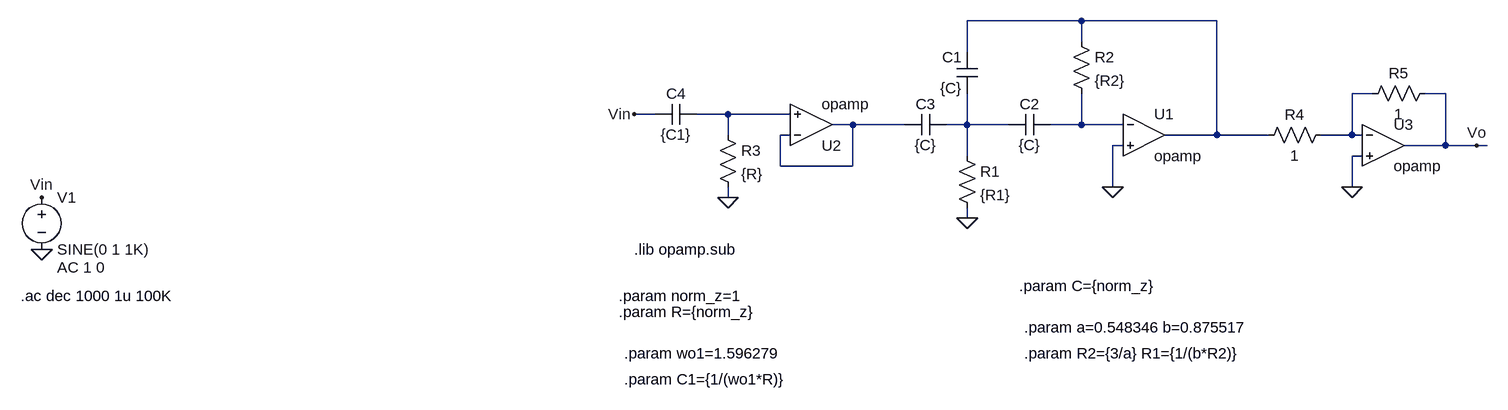
[diagram p0: schematic MFB_normalizado.asc]
MFB_normalizado.asc, the LTspice schematic file:
Version 4.1
SHEET 1 2160 696
WIRE 432 -64 256 -64
WIRE 640 -64 432 -64
WIRE 432 -32 432 -64
WIRE 256 -16 256 -64
WIRE 880 48 848 48
WIRE 992 48 960 48
WIRE -224 80 -256 80
WIRE -112 80 -160 80
WIRE -16 80 -112 80
WIRE 80 96 48 96
WIRE 160 96 80 96
WIRE 256 96 256 48
WIRE 256 96 224 96
WIRE 320 96 256 96
WIRE 432 96 432 48
WIRE 432 96 384 96
WIRE 496 96 432 96
WIRE -112 112 -112 80
WIRE -16 112 -32 112
WIRE 640 112 640 -64
WIRE 640 112 560 112
WIRE 720 112 640 112
WIRE 848 112 848 48
WIRE 848 112 800 112
WIRE 864 112 848 112
WIRE 496 128 480 128
WIRE 992 128 992 48
WIRE 992 128 928 128
WIRE 1040 128 992 128
WIRE 1056 128 1040 128
WIRE 256 144 256 96
WIRE 864 144 848 144
WIRE -32 160 -32 112
WIRE 80 160 80 96
WIRE 80 160 -32 160
WIRE 480 192 480 128
WIRE 848 192 848 144
WIRE -112 208 -112 192
WIRE 256 240 256 224
FLAG -1168 288 0
FLAG -1168 208 Vin
FLAG 480 192 0
FLAG 256 240 0
FLAG 1040 128 Vo
FLAG -112 208 0
FLAG -256 80 Vin
FLAG 848 192 0
SYMBOL OpAmps\\opamp 528 48 R0
SYMATTR InstName U1
SYMBOL voltage -1168 192 R0
WINDOW 123 24 124 Left 2
WINDOW 39 0 0 Left 0
SYMATTR Value2 AC 1 0
SYMATTR InstName V1
SYMATTR Value SINE(0 1 1K)
SYMBOL res 240 128 R0
SYMATTR InstName R1
SYMATTR Value {R1}
SYMBOL cap 272 48 R180
WINDOW 0 24 56 Left 2
WINDOW 3 24 8 Left 2
SYMATTR InstName C1
SYMATTR Value {C}
SYMBOL cap 320 112 R270
WINDOW 0 32 32 VTop 2
WINDOW 3 0 32 VBottom 2
SYMATTR InstName C2
SYMATTR Value {C}
SYMBOL cap 160 112 R270
WINDOW 0 32 32 VTop 2
WINDOW 3 0 32 VBottom 2
SYMATTR InstName C3
SYMATTR Value {C}
SYMBOL res 416 -48 R0
SYMATTR InstName R2
SYMATTR Value {R2}
SYMBOL res -128 96 R0
SYMATTR InstName R3
SYMATTR Value {R}
SYMBOL cap -160 64 R90
WINDOW 0 0 32 VBottom 2
WINDOW 3 32 32 VTop 2
SYMATTR InstName C4
SYMATTR Value {C1}
SYMBOL OpAmps\\opamp 16 160 M180
SYMATTR InstName U2
SYMBOL OpAmps\\opamp 896 64 R0
SYMATTR InstName U3
SYMBOL res 816 96 R90
WINDOW 0 0 56 VBottom 2
WINDOW 3 32 56 VTop 2
SYMATTR InstName R4
SYMATTR Value 1
SYMBOL res 976 32 R90
WINDOW 0 0 56 VBottom 2
WINDOW 3 32 56 VTop 2
SYMATTR InstName R5
SYMATTR Value 1
TEXT -1200 360 Left 2 !.ac dec 1000 1u 100K
TEXT -256 288 Left 2 !.lib opamp.sub
TEXT 336 344 Left 2 !.param C={norm_z}
TEXT 344 408 Left 2 !.param a=0.548346 b=0.875517
TEXT 344 448 Left 2 !.param R2={3/a} R1={1/(b*R2)}
TEXT -280 360 Left 2 !.param norm_z=1
TEXT -280 384 Left 2 !.param R={norm_z}
TEXT -272 448 Left 2 !.param wo1=1.596279
TEXT -272 488 Left 2 !.param C1={1/(wo1*R)}

The netlist it stands for:
* MFB_normalizado.asc
X§U1 N006 0 N001 opamp Aol=100K GBW=10Meg  ; pins invin noninvin out
V1 Vin 0 SINE(0 1 1K) AC 1 0
R1 N005 0 {R1}
C1 N005 N001 {C}
C2 N005 N006 {C}
C3 N004 N005 {C}
R2 N001 N006 {R2}
R3 N003 0 {R}
C4 N003 Vin {C1}
X§U2 N004 N003 N004 opamp Aol=100K GBW=10Meg  ; pins invin noninvin out
X§U3 N002 0 Vo opamp Aol=100K GBW=10Meg  ; pins invin noninvin out
R4 N002 N001 1
R5 Vo N002 1
.ac dec 1000 1u 100K
.lib opamp.sub
.param C={norm_z}
.param a=0.548346 b=0.875517
.param R2={3/a} R1={1/(b*R2)}
.param norm_z=1
.param R={norm_z}
.param wo1=1.596279
.param C1={1/(wo1*R)}
.backanno
.end